# EAGLE design IL01 (EAGLE 6.3)
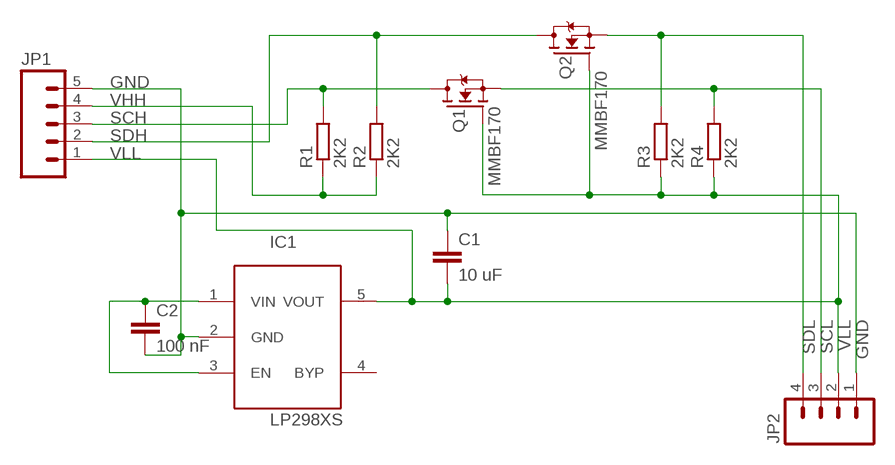
[diagram p0: schematic, sheet 1]

## Parts
C1  10 uF  C-EUC1206  [C1206]
C2  100 nF  C-EUC0805  [C0805]
IC1  LP298XS  [SOT23-5L]
JP1  M05PTH  [1X05]
JP2  M04PTH  [1X04]
Q1  MMBF170  TRANSISTOR_FET_BS170-SOT-23  [SOT-23]
Q2  MMBF170  TRANSISTOR_FET_BS170-SOT-23  [SOT-23]
R1  2K2  R-EU_R0603  [R0603]
R2  2K2  R-EU_R0603  [R0603]
R3  2K2  R-EU_R0603  [R0603]
R4  2K2  R-EU_R0603  [R0603]

## Nets
GND: C1.1 C2.2 IC1.2(GND) JP1.5 JP2.1
SCH: JP1.3 Q1.3(D) R1.2
SCL: JP2.4 Q2.2(S) R3.2
SDH: JP1.2 Q2.3(D) R2.2
SDL: JP2.3 Q1.2(S) R4.2
VHH: C2.1 IC1.1(VIN) IC1.3(EN) JP1.4 R1.1 R2.1
VLL: C1.2 IC1.5(VOUT) JP1.1 JP2.2 Q1.1(G) Q2.1(G) R3.1 R4.1
Unconnected: IC1.4(BYP)

## Library data of the parts
C1 C2 = rcl:C-EU: CAPACITOR, European symbol
IC1 = adafruit:LP298X
JP1 = SparkFun:M05: Header 5 Standard 5-pin 0.1" header. Use with straight break away headers (SKU : PRT-00116), right angle break away headers (PRT-00553), swiss pins (PRT-00743), machine pins (PRT-00117), and female headers (PRT-00115). Molex polarized connector foot print use with SKU : PRT-08230 with associated crimp pins and housings.
JP2 = SparkFun:M04: Header 4 Standard 4-pin 0.1" header. Use with straight break away headers (SKU : PRT-00116), right angle break away headers (PRT-00553), swiss pins (PRT-00743), machine pins (PRT-00117), and female headers (PRT-00115). Molex polarized connector foot print use with SKU : PRT-08231 with associated crimp pins and housings. 1MM SMD Version SKU: PRT-10208
Q1 Q2 = dp_devices:TRANSISTOR_FET_BS170: N-Channel Enhancement Mode Field Effect Transistor
R1-R4 = rcl:R-EU_: RESISTOR, European symbol

## Board
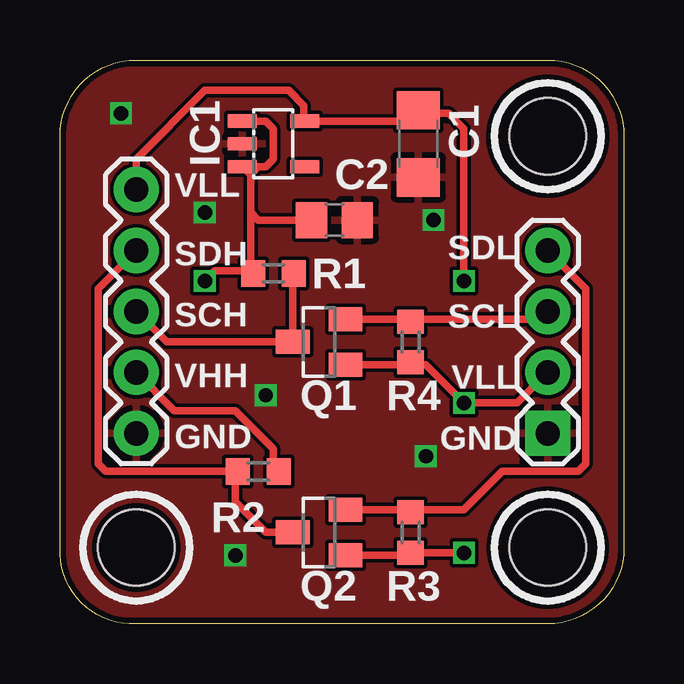
[diagram p1: board, top side]
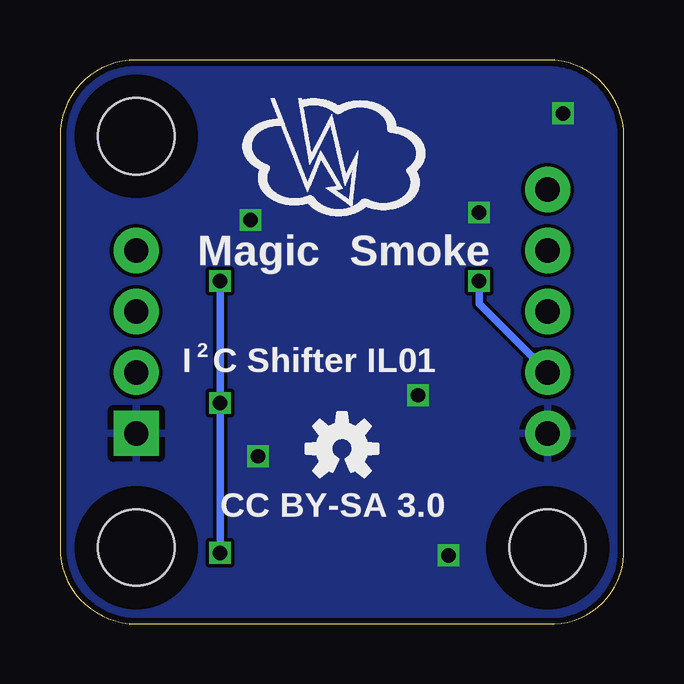
[diagram p2: board, bottom side, seen from below]

Size 23.5 x 23.5 mm. Coordinates in mm from the lower left corner, seen from the top.
Outline: 0,3.18 0,20.32 arc-90 3.18,23.5 20.32,23.5 arc-90 23.5,20.32 23.5,3.18 arc-90 20.32,0 3.18,0 arc-96 0,3.18
Copper layers (1*2*15*16): Top 0.035mm / dielectric 0.2mm / layer 2 0.0175mm / dielectric 1.1mm / layer 15 0.0175mm / dielectric 0.2mm / Bottom 0.035mm
Design rules "SeeedStudio_DRU_no_angle_20130527": minimum track width 6mil, minimum drill 12mil, track to track 6mil, track to pad 6mil, pad to pad 6mil, via to via 6mil, smd to smd 0mil, copper to edge 10mil, drill to drill 10mil, minimum pad ring 6mil, minimum via ring 6mil, stop-mask expansion 2mil, vias tented up to drill 25mil, thermal gap 10mil
Holes 3.17 mm at 20.32,3.18 20.32,20.32 3.18,3.18
tRestrict: area 17.8,17.8 to 22.9,22.9; area 17.8,0.6 to 22.9,5.7
bRestrict: area 17.8,17.8 to 22.9,22.9; area 17.8,0.6 to 22.9,5.7; area 0.6,0.6 to 5.7,5.7

### Footprints (pad centres in the part's own frame; a part is rotated, then mirrored left to right if it is on the bottom)
C1206 = smd 1.6 x 1.8: 1 -1.4,0; 2 1.4,0
C0805 = smd 1.3 x 1.5: 1 -0.95,0; 2 0.95,0
SOT23-5L = smd 0.55 x 1.2: 1 -0.95,-1.3; 2 0,-1.3; 3 0.95,-1.3; 4 0.95,1.3; 5 -0.95,1.3
1X05 = drill 1.016 pad 1.88: 1 0,0; 2 2.54,0; 3 5.08,0; 4 7.62,0; 5 10.16,0
1X04 = drill 1.016 pad 1.88 square: 1 0,0 | drill 1.016 pad 1.88: 2 2.54,0; 3 5.08,0; 4 7.62,0
SOT-23 = smd 1 x 1.4: 1 -0.95,-1.1; 2 0.95,-1.1; 3 0,1.1
R0603 = smd 1 x 1.1: 1 -0.85,0; 2 0.85,0

### Placement (x,y rotation side)
C1  14.92,20 90 top
C2  11.43,16.83 0 top
IC1  8.89,20 270 top
JP1  3.18,18.1 270 top
JP2  20.32,7.94 90 top
Q1  10.8,11.75 90 top
Q2  10.8,3.81 90 top
R1  8.89,14.61 0 top
R2  8.26,6.35 180 top
R3  14.61,3.81 90 top
R4  14.61,11.75 90 top
U$3  [OSHW-LOGO-S]  11.75,7.3 0 bottom

### Tracks (layer width: path | path; a pad name or v marks a point on that pad's centre or on a via)
GND  (via drill 0.6)
  other vias: 15.56,16.83 8.57,9.53 7.3,2.86 2.54,21.27 6.03,17.15 15.24,6.99
  pour Top: -0.63,24.13 24.13,24.13 24.13,-0.63 -0.63,-0.63
  pour Bottom: -0.32,23.81 23.81,23.81 23.81,-0.32 -0.32,-0.32
SCH
  Top 0.305: R1.2 9.7,14.56 Q1.3 4.45,11.75 JP1.3
SCL
  Top 0.305: Q2.2 14.51,4.76 R3.2 14.71,4.76 16.83,4.76 18.42,6.35 21.59,6.35 21.91,6.67 21.91,13.97 JP2.4
SDH
  Top 0.305: JP1.2 1.59,13.97 1.59,6.67 1.91,6.35 R2.2 7.3,6.25 7.3,5.08 8.57,3.81 Q2.3
SDL
  Top 0.305: Q1.2 14.51,12.7 R4.2 14.71,12.7 20,12.7 JP2.3
VHH  (via drill 0.6)
  Top 0.305: IC1.1 8.58,20.95 8.89,20.64 8.89,19.37 8.58,19.05 8.26,19.05 | 8.26,19.05 IC1.3 7.94,18.71 7.94,17.15 | 8.26,19.05 8.04,18.84 | 7.94,14.71 7.94,17.15 | C2.1 8.26,16.83 7.94,17.15 | 7.94,14.71 6.45,14.71 v6.03,14.29 | 7.94,14.71 R1.1 | JP1.4 4.76,8.89 7.3,8.89 8.89,7.3 8.89,6.57 R2.1
  Bottom 0.305: JP1.4 6.03,13.34 v6.03,14.29
VLL  (via drill 0.6)
  Top 0.305: C1.2 14.51,20.95 IC1.5 10.16,20.98 10.16,21.59 9.53,22.23 6.03,22.23 3.18,19.37 JP1.1 | 15.34,21.27 C1.2 | Q2.1 14.51,2.86 R3.1 v16.83,2.96 | Q1.1 14.51,10.8 R4.1 14.71,10.8 15.24,10.8 v16.83,9.21 19.05,9.21 JP2.2 | v16.83,14.29 16.83,20.64 16.19,21.27 15.37,21.27 C1.2
  Bottom 0.305: v16.83,2.96 v16.83,9.21 v16.83,14.29

### Text on the board
tPlace: VLL | SDL | SDH | SCL | SCH | VLL | VHH | GND | GND
bPlace: Smoke | Magic | 2 | C Shifter IL01 | I | CC BY-SA 3.0